# Altium schematic sheet Motor.SchDoc
size A4; SheetNumber: 2; SheetTotal: 2
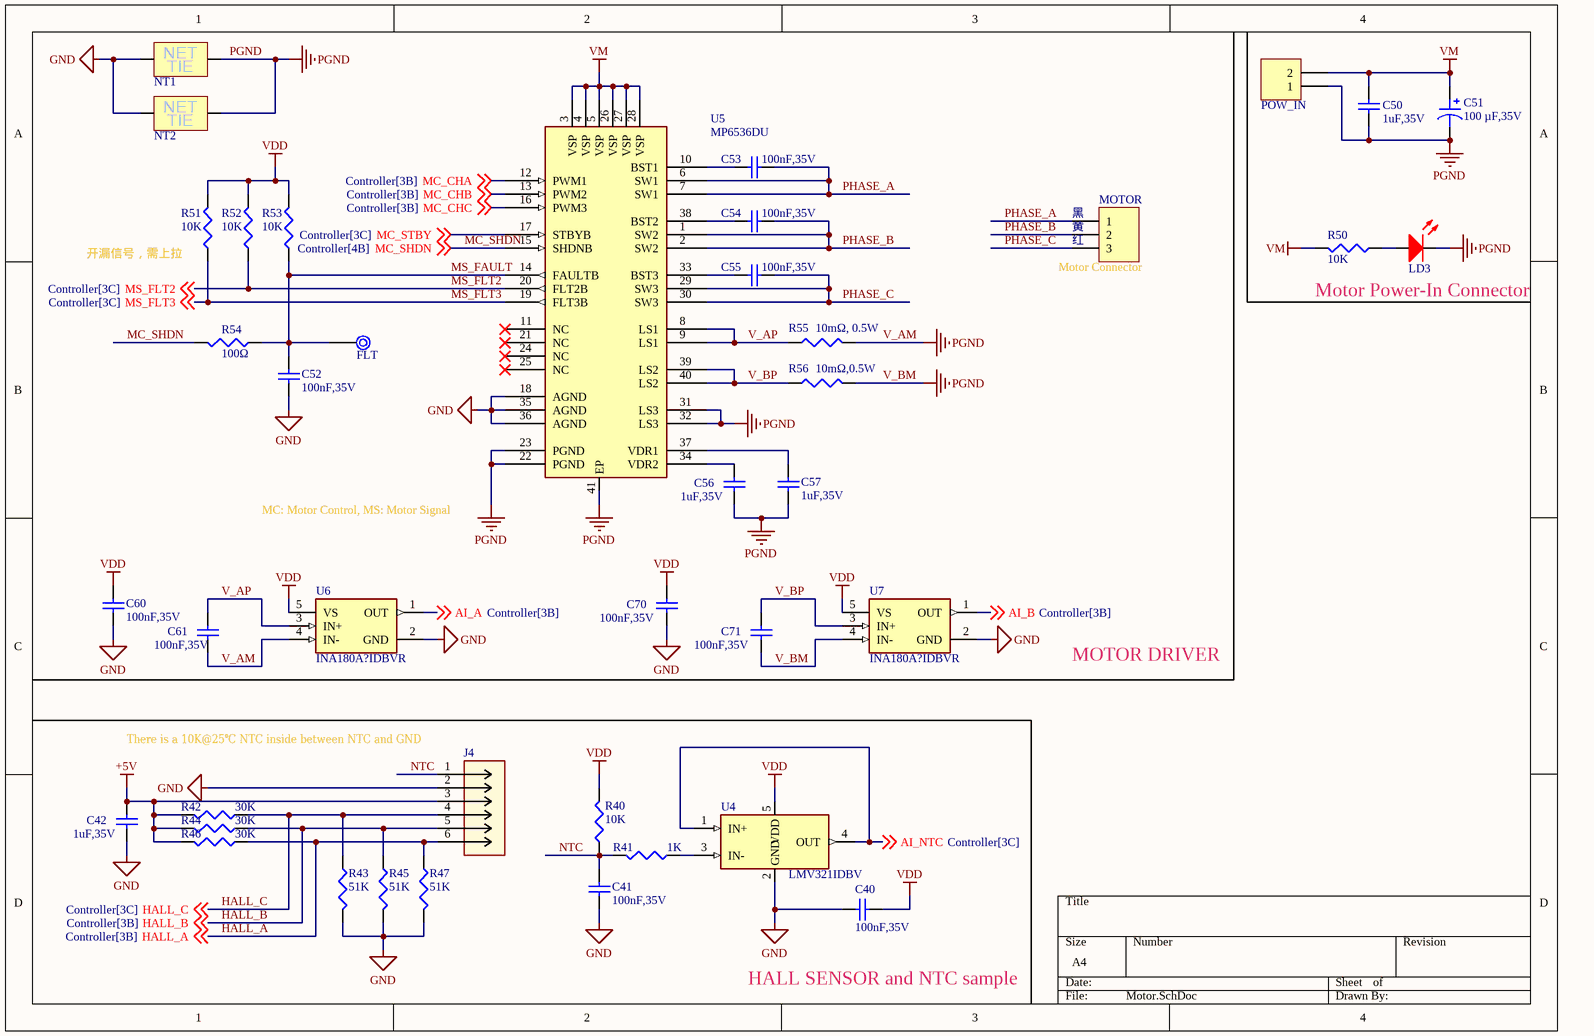
[diagram p0: Motor.SchDoc]

## Parts
C40  value 100nF,35V  [CAPC1005L]  (hidden comment: MLCC)
C41  value 100nF,35V  [CAPC1005L]  (hidden comment: MLCC)
C42  value 1uF,35V  [CAPC1608L]  (hidden comment: MLCC)
C50  value 1uF,35V  [CAPC1608L]  (hidden comment: MLCC)
C51  100 µF,35V  [CAP ALSMD 6.6MM H7.7MM]
C52  value 100nF,35V  [CAPC1005L]  (hidden comment: MLCC)
C53  value 100nF,35V  [CAPC1005L]  (hidden comment: MLCC)
C54  value 100nF,35V  [CAPC1005L]  (hidden comment: MLCC)
C55  value 100nF,35V  [CAPC1005L]  (hidden comment: MLCC)
C56  value 1uF,35V  [CAPC1608L]  (hidden comment: MLCC)
C57  value 1uF,35V  [CAPC1608L]  (hidden comment: MLCC)
C60  value 100nF,35V  [CAPC1005L]  (hidden comment: MLCC)
C61  value 100nF,35V  [CAPC1005L]  (hidden comment: MLCC)
C70  value 100nF,35V  [CAPC1005L]  (hidden comment: MLCC)
C71  value 100nF,35V  [CAPC1005L]  (hidden comment: MLCC)
FLT  Test Point  [TPSMD-Small]  (value not drawn)
J4  530470610  [MOLEX_PicoBlade_53047-0610]  (value not drawn)
LD3  LED  [LED_0603_AK_Red]  (value not drawn)
MOTOR  B3B-XH-A  [B3B-XH-A]  (value not drawn)
NT1  Net Tie  [NET-TIE-50MIL-Block]  (value not drawn)  (net tie, no BOM)
NT2  Net Tie  [NET-TIE-50MIL-Block]  (value not drawn)  (net tie, no BOM)
POW_IN  5267-02A  [Molex-5267-02a]  (value not drawn)
R40  value 10K  [RESC1005L]  (hidden comment: RES, SMT)
R41  value 1K  [RESC1005L]  (hidden comment: RES, SMT)
R42  value 30K  [RESC1005L]  (hidden comment: RES, SMT)
R43  value 51K  [RESC1005L]  (hidden comment: RES, SMT)
R44  value 30K  [RESC1005L]  (hidden comment: RES, SMT)
R45  value 51K  [RESC1005L]  (hidden comment: RES, SMT)
R46  value 30K  [RESC1005L]  (hidden comment: RES, SMT)
R47  value 51K  [RESC1005L]  (hidden comment: RES, SMT)
R50  value 10K  [RESC1005L]  (hidden comment: RES, SMT)
R51  value 10K  [RESC1005L]  (hidden comment: RES, SMT)
R52  value 10K  [RESC1005L]  (hidden comment: RES, SMT)
R53  value 10K  [RESC1005L]  (hidden comment: RES, SMT)
R54  value 100Ω  [RESC1005L]  (hidden comment: RES, SMT)
R55  value 10mΩ, 0.5W  [RESC2012L]  (hidden comment: RES, SMT)
R56  value 10mΩ,0.5W  [RESC2012L]  (hidden comment: RES, SMT)
U4  LMV321IDBV  [TI_DBV0005A]
U5  MP6536DU  [QFN40-5x5_MP6536]
U6  INA180A?IDBVR  [TI_DBV0005A]
U7  INA180A?IDBVR  [TI_DBV0005A]

## Nets
+5V: C42.1 J4.3 R42.2 R44.2 R46.2
GND: C40.1 C41.2 C42.2 C52.2 C60.2 C70.2 J4.2 NT1.1(AG) NT2.1(AG) R43.2 R45.2 R47.2 U4.2(GND) U5.18(AGND) U5.35(AGND) U5.36(AGND) U6.2(GND) U7.2(GND)
PGND: C50.1 C51.2 C56.2 C57.2 C61.2 C71.2 LD3.K NT1.2(G) NT2.2(G) POW_IN.1 R55.2 R56.2 U5.22(PGND) U5.23(PGND) U5.31(LS3) U5.32(LS3) U5.41(EP) U6.4(IN-) U7.4(IN-)  [also labelled V_AM, V_BM]
VDD: C40.2 C60.1 C70.1 R40.2 R51.2 R52.2 R53.2 U4.5(VDD) U6.5(VS) U7.5(VS)
VM: C50.2 C51.1 POW_IN.2 R50.2 U5.3(VSP) U5.4(VSP) U5.5(VSP) U5.26(VSP) U5.27(VSP) U5.28(VSP)
AI_A: U6.1(OUT) ; off-sheet AI_A
AI_B: U7.1(OUT) ; off-sheet AI_B
AI_NTC: U4.1(IN+) U4.4(OUT) ; off-sheet AI_NTC
HALL_A: J4.6 R46.1 R47.1 ; off-sheet HALL_A
HALL_B: J4.5 R44.1 R45.1 ; off-sheet HALL_B
HALL_C: J4.4 R42.1 R43.1 ; off-sheet HALL_C
MC_CHA: U5.12(PWM1) ; off-sheet MC_CHA
MC_CHB: U5.13(PWM2) ; off-sheet MC_CHB
MC_CHC: U5.16(PWM3) ; off-sheet MC_CHC
MC_SHDN: R54.2 U5.15(SHDNB) ; off-sheet MC_SHDN
MC_STBY: U5.17(STBYB) ; off-sheet MC_STBY
MS_FAULT: C52.1 FLT.1 R53.1 R54.1 U5.14(FAULTB)
MS_FLT2: R52.1 U5.20(FLT2B) ; off-sheet MS_FLT2
MS_FLT3: R51.1 U5.19(FLT3B) ; off-sheet MS_FLT3
NTC: C41.1 J4.1 R40.1 R41.2
PHASE_A: C53.1 MOTOR.1 U5.6(SW1) U5.7(SW1)
PHASE_B: C54.1 MOTOR.2 U5.1(SW2) U5.2(SW2)
PHASE_C: C55.1 MOTOR.3 U5.29(SW3) U5.30(SW3)
V_AP: C61.1 R55.1 U5.8(LS1) U5.9(LS1) U6.3(IN+)
V_BP: C71.1 R56.1 U5.39(LS2) U5.40(LS2) U7.3(IN+)
NetC53_2: C53.2 U5.10(BST1)
NetC54_2: C54.2 U5.38(BST2)
NetC55_2: C55.2 U5.33(BST3)
NetC56_1: C56.1 U5.34(VDR2)
NetC57_1: C57.1 U5.37(VDR1)
NetLD3_A: LD3.A R50.1
NetR41_1: R41.1 U4.3(IN-)

Not connected (* = marked no-connect by the designer): U5 11(NC)* 21(NC)* 24(NC)* 25(NC)*

## Notes on the sheet
- (near MOTOR) 黑
- (near MOTOR) 黄
- (near MOTOR) 红
- 开漏信号，需上拉
- (near MOTOR) Motor Connector
- Motor Power-In Connector
- MC: Motor Control, MS: Motor Signal
- MOTOR DRIVER
- There is a 10K@25℃ NTC inside between NTC and GND
- HALL SENSOR and NTC sample
- (in symbol NET-TIE-GROUND) NET; TIE

## Library data of the parts
C40 C41 C52-C55 C60 C61 C70 C71 = Cap: MLCC, 0402(1005); Published: 8-Jun-2000; LatestRevisionDate: 17-Jul-2002; LatestRevisionNote: Re-released for DXP Platform.; PackageReference: RAD-0.3; Publisher: Altium Limited; PackageDescription: Radial Cap, Thru-Hole; 2 Leads; 0.3 in Pin Spacing
C42 C50 C56 C57 = Cap: MLCC, 0603(1608); Published: 8-Jun-2000; LatestRevisionDate: 17-Jul-2002; LatestRevisionNote: Re-released for DXP Platform.; PackageReference: RAD-0.3; Publisher: Altium Limited; PackageDescription: Radial Cap, Thru-Hole; 2 Leads; 0.3 in Pin Spacing
C51 = EEE-1VA101XAP: CAP ALUM 100UF 20% 35V SMD; manufacturer: Panasonic Electronic Components; Capacitance: 100 µF; Lifetime @ Temp.: 2000 Hrs @ 85°C; Polarization: Polar; Ripple Current @ High Frequency: 224.4 mA @ 10 kHz; Ripple Current @ Low Frequency: 132 mA @ 120 Hz; Surface Mount Land Size: 0.260" L x 0.260" W (6.60mm x 6.60mm); Part Number: EEE-1VA101XAP; Applications: Automotive; componentlink1description: Datasheet; componentlink1url: https://industrial.panasonic.com/cdbs/www-data/pdf/RDE0000/ABA0000C1142.pdf; componentlink2description: DigiKey Link; componentlink2url: https://www.digikey.com/en/products/detail/panasonic-electronic-components/EEE-1VA101XAP/1717799; Device Package: Radial, Can - SMD; Height - Seated (Max): 0.303" (7.70mm); lastupdated: 2023/1/24 22:26:09; Lifecycle Status: Active; Minimum Order: 1; Mounting Type: Surface Mount; Operating Temperature: -40°C ~ 85°C; Package / Case: Radial, Can - SMD; packaging: TapeAndReel; partid: 27502; Part Status: Active; price: 0.18; Ratings: AEC-Q200; series: S; Size / Dimension: 0.248" Dia (6.30mm); Supplier 1: DigiKey; Supplier Part Number 1: PCE4633CT-ND; Tolerance: ±20%; value: 100 µF,35V; Voltage - Rated: 35 V
FLT = TestPoint
J4 = MOLEX_PicoBlade_53047-0610: MOLEX, PicoBlade Header with 1.25mm gap distance, 53047-0610, Through hole, Vertical type with 6 Circuit.
LD3 = LED_0603_RED: RED LED, 0603
MOTOR = B3B-XH-A: JST XH Series, Pitch 2.5mm, Top Entry, 3Pins
NT1 NT2 = NET-TIE-GROUND
POW_IN = Molex-5267-02A: 2.50mm Pitch, Mini-SPOX PCB Header, Single Row, Vertical, Through Hole, Tin Plating, 2 Circuits, Bag, 3.50mm PC Tail Length
R40-R47 R50-R54 = Res3: Resistor, 0402(1005); Published: 8-Jun-2000; LatestRevisionDate: 29-May-2009; LatestRevisionNote: IPC-7351 Footprint Added.; PackageReference: J1-0603; Publisher: Altium Limited; PackageDescription: Chip Resistor
R55 R56 = Res3: Resistor, 0805(2012); Published: 8-Jun-2000; LatestRevisionDate: 29-May-2009; LatestRevisionNote: IPC-7351 Footprint Added.; PackageReference: J1-0603; Publisher: Altium Limited; PackageDescription: Chip Resistor
U4 = LMV321IDBV: LMV321, Single, 5.5-V, 1-MHz, RRO operational amplifier, SOT-23-5(DBV) package
U5 = MP6536DU: MPS, MP6536DU-LF-P/Z, 26V, 5.5A, 3-Channel Half-Bridge Driver, QFN40 5mmx5mm package
U6 U7 = INA180A?IDBVR: TI, 26V, 350kHz current sense amplifier, 1 Channel, DBV Package